# Altium project SMD_Bed_Main.PrjPcb
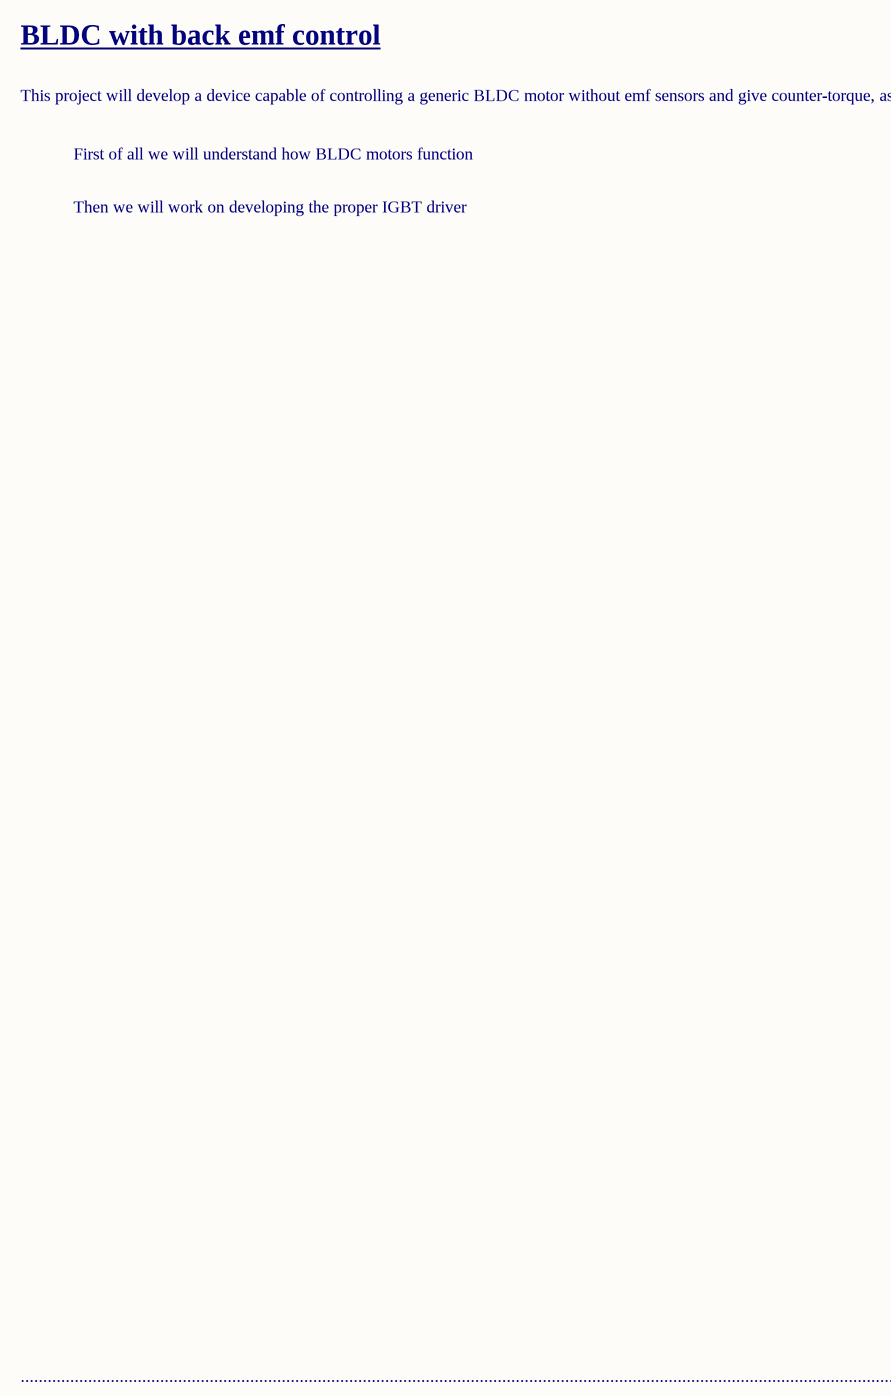
[diagram p0: 000-Cover.SchDoc]
4 sheets, 27 parts. Net scope: global (net labels, ports and power ports of the same name join across sheets).
Board file: SMD_Bed_Main_revA.PcbDoc
Sheets:
  000-Change logs.SchDoc
  000-Cover.SchDoc
  001-Main.SchDoc
  002-MCU.SchDoc

## Sheet 000-Change logs.SchDoc
size A4; SheetNumber: 1; SheetTotal: 5

## Sheet 000-Cover.SchDoc
size 431 x 279 mm; Organization: ORGANIZATION; Address1: ADDRESS 1; Address2: ADDRESS 2; Address3: ADDRESS 3; Address4: ADDRESS 4; Revision: -; ENG_APP_DATE: --/--/--; DSN_APP_DATE: --/--/--; CHK_APP_DATE: --/--/--

### Notes on the sheet
- BLDC with back emf control
- This project will develop a device capable of controlling a generic BLDC motor without emf sensors and give counter-torque, as the steering wheel of a F1 simulator
- First of all we will understand how BLDC motors function
- Then we will work on developing the proper IGBT driver
- ..........................................................................................................................................................................................................................................................................
- DWG. NO.
- REV.
- SHT.
- THIS DOCUMENT AND THE DATA DISCLOSED HEREIN OR HEREWITH IS THE PROPERTY OF ALTIUM LIMITED AND MAY BE FREELY DISTRIBUTED IN WHOLE. NO RIGHTS ARE RESERVED OR EXPRESS OR IMPLIED WARANTEE GIVEN.
- REVISION
- DESCRIPTION
- DATE
- APPROVED
- ENG:
- APPROVALS
- PROJECT
- DSN:
- CHK:
- REFERENCE DOCUMENTS
- PROJECT REVISION:
- TITLE
- DOCUMENT REVISION:
- DESIGN ITEM:
- BOM:
- FAB DWG:
- PCB DWG:
- ASSY DWG:
- SCALE:
- SIZE
- B
- CAGE CODE
- FILE NAME
- DWG NO.
- SHEET
- OF
- REV

## Sheet 001-Main.SchDoc
size A4; SheetNumber: 4; SheetTotal: 5
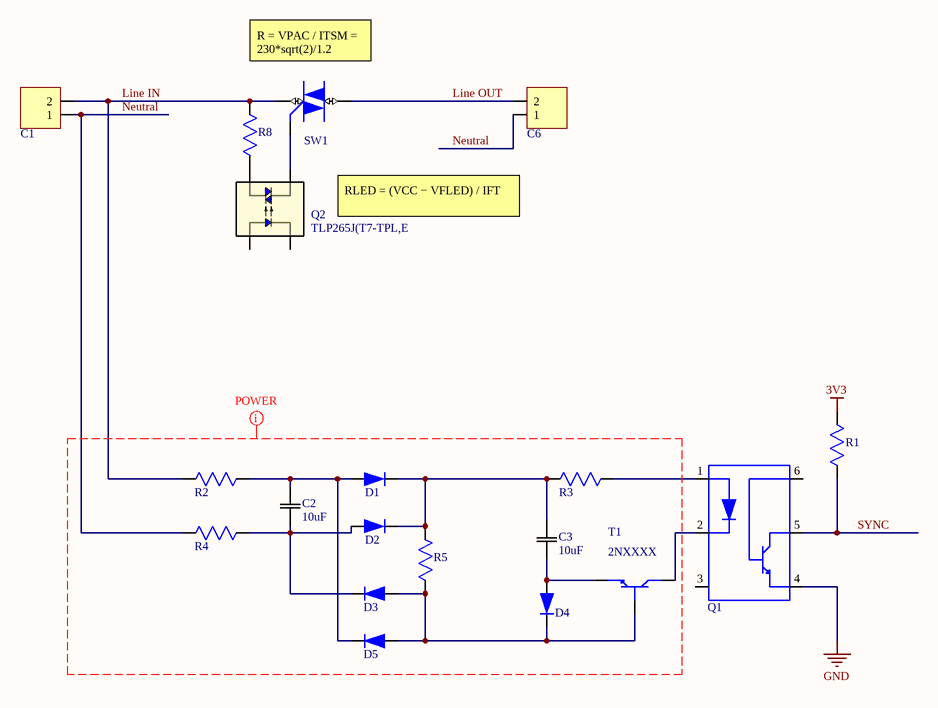
[diagram p1: 001-Main.SchDoc]

### Parts
C1  DG128-5.0-02P-14  [DG128-5.0-02P-14]  (value not drawn)
C2  10uF  [CAP 0603/1608]
C3  10uF  [CAP 0603/1608]
C6  DG128-5.0-02P-14  [DG128-5.0-02P-14]  (value not drawn)
D1  MMSD4148T1G  [SOD-123]  (value not drawn)
D2  MMSD4148T1G  [SOD-123]  (value not drawn)
D3  MMSD4148T1G  [SOD-123]  (value not drawn)
D4  MMSD4148T1G  [SOD-123]  (value not drawn)
D5  MMSD4148T1G  [SOD-123]  (value not drawn)
Q1  4N35  [DIP6-2.54]  (value not drawn)
Q2  TLP265J(T7-TPL,E  [4pin SO6_TOS]
R1  CRCW06031K00FKEA  [CAP 0603/1608]  (value not drawn)
R2  CRCW06031K00FKEA  [CAP 0603/1608]  (value not drawn)
R3  CRCW06031K00FKEA  [CAP 0603/1608]  (value not drawn)
R4  CRCW06031K00FKEA  [CAP 0603/1608]  (value not drawn)
R5  CRCW06031K00FKEA  [CAP 0603/1608]  (value not drawn)
R8  CRCW06031K00FKEA  [CAP 0603/1608]  (value not drawn)
SW1  T810T-8G-TR  [D2PAK]  (value not drawn)
T1  2NXXXX  [TO-92]

### Nets
3V3: R1.2
GND: Q1.4(EMITER)
Line IN: C1.2 R2.1 R8.2 SW1.1(A1)
Line OUT: C6.2 SW1.2(A2)
Neutral: C1.1 C6.1 R4.1
SYNC: Q1.5(COLLECTOR) R1.1
NetC2_1: C2.1 D2.1(K) D3.2(A) R4.2
NetC2_2: C2.2 D1.1(K) D5.2(A) R2.2
NetC3_1: C3.1 D4.1(K) T1.3(E)
NetC3_2: C3.2 D1.2(A) D2.2(A) R3.1 R5.1
NetD3_1: D3.1(K) D4.2(A) D5.1(K) R5.2 T1.1(B)
NetQ1_1: Q1.1(ANODE) R3.2
NetQ1_2: Q1.2(CATHODE) T1.2(C)
NetQ2_4: Q2.4 SW1.3(G)
NetQ2_6: Q2.6 R8.1

Not connected (* = marked no-connect by the designer): Q1 3(NC) 6(BASE); Q2 1 3

### Layout directives
net class AC; rule Supply Nets [Voltage = 230.0]; rule Signal Stimulus [Kind - Single Pulse    Level - High    Start Time = 0.000    Stop Time = 10.00m    Period Time = 20.00m]: (no net found under the mark)

### Notes on the sheet
- R = VPAC / ITSM = 230*sqrt(2)/1.2
- RLED = (VCC − VFLED) / IFT

### Library data of the parts
C1 C6 = Connector 2P 5.0mm
C2 C3 = CL10A106KQ8NNNC: CAP 10uF Ceramic 0603 capacitor; Mfr_Name: Samsung
D1-D5 = MMSD4148T1G: DIODE; Manufacturer_Name: onsemi; Copyright: Copyright (C) 2025 Ultra Librarian. All rights reserved.; Manufacturer_Part_Number: MMSD4148T1G; RefDes: RefDes; Type: Type
Q1 = 4N35: Optoisolator Transistor with Base Output 5000Vrms 1 Channel 6-DIP; MF: Vishay; Purchase-URL: https://pricing.snapeda.com/search/part/4N35/?ref=eda; Price: None; SnapEDA_Link: https://www.snapeda.com/parts/4N35/Vishay%20Semiconductor%20Opto%20Division/view-part/579099/?ref=snap; MP: 4N35; Availability: Good; Value: *; Check_prices: https://www.snapeda.com/parts/4N35/Vishay%20Semiconductor%20Opto%20Division/view-part/579099/?ref=eda; Package: DIP-6 Texas Instruments
Q2 = TLP265JT7-TPL,E: No Description Available; Manufacturer_Name: Toshiba Electronic Devices & Storage Corp.; Number_devices_in_Package: 1; Copyright: Copyright (C) 2025 Ultra Librarian. All rights reserved.; Manufacturer_Part_Number: TLP265J(T7-TPL,E; Source_Package: TLP265J; RefDes: Refdes; Type: Type
R1-R5 R8 = CRCW06031K00FKEA: D11/CRCW0603 100 1K 1% ET1 e3; Manufacturer_Name: Vishay; Copyright: Copyright (C) 2025 Ultra Librarian. All rights reserved.; Manufacturer_Part_Number: CRCW06031K00FKEA; Datasheet: https://www.vishay.com/doc?20035
SW1 = T810T-8G-TR: 8A 800V 150&#176;C D&#178;PAK Logic Level T-Series Triac; Manufacturer_Name: STMicroelectronics; Copyright: Copyright (C) 2025 Ultra Librarian. All rights reserved.; Manufacturer_Part_Number: T810T-8G-TR; Datasheet: https://www.st.com/resource/en/datasheet/t810t-8g.pdf; RefDes: RefDes; Type: Type

## Sheet 002-MCU.SchDoc
size A4; SheetNumber: 5; SheetTotal: 5
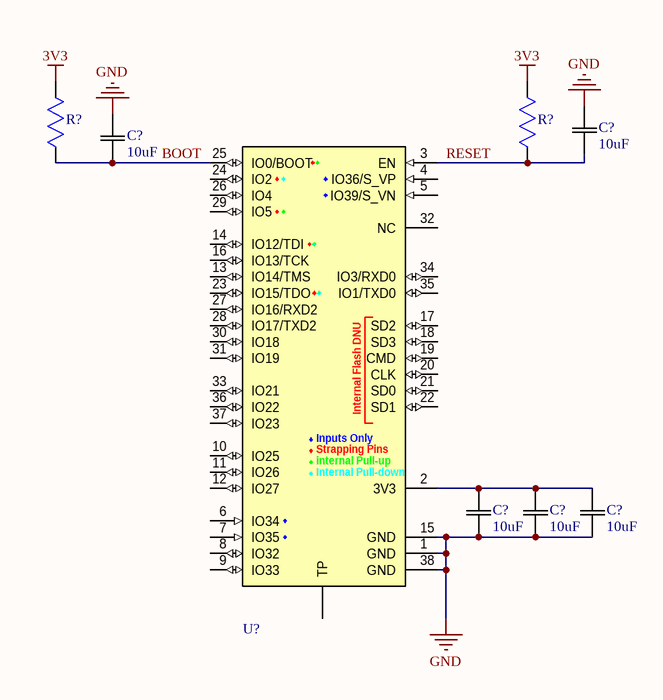
[diagram p2: 002-MCU.SchDoc]

### Parts
(Parts that share a designator on the sheet are numbered #1, #2 ... from top to bottom, then left to right.)
C?#1  10uF  [CAP 0603/1608]
C?#2  10uF  [CAP 0603/1608]
C?#3  10uF  [CAP 0603/1608]
C?#4  10uF  [CAP 0603/1608]
C?#5  10uF  [CAP 0603/1608]
R?#1  CRCW06031K00FKEA  [CAP 0603/1608]  (value not drawn)
R?#2  CRCW06031K00FKEA  [CAP 0603/1608]  (value not drawn)
U?  Red markers can't be pull up. Blue markers can't be pull down.  [ESP32­WROOM­32E_EXP]  (value not drawn)

### Nets
3V3: R?#1.2 R?#2.2
GND: C?#1.2 C?#2.2 C?#3.1 C?#4.1 C?#5.1 U?.1(GND) U?.15(GND) U?.38(GND)
BOOT: C?#2.1 R?#1.1 U?.25(IO0/BOOT)
RESET: C?#1.1 R?#2.1 U?.3(EN)
NetC?#3_2: C?#3.2 C?#4.2 C?#5.2 U?.2(3V3)

Not connected (* = marked no-connect by the designer): U? 4(IO36/S_VP) 5(IO39/S_VN) 6(IO34) 7(IO35) 8(IO32) 9(IO33) 10(IO25) 11(IO26) 12(IO27) 13(IO14/TMS) 14(IO12/TDI) 16(IO13/TCK) 17(SD2) 18(SD3) 19(CMD) 20(CLK) 21(SD0) 22(SD1) 23(IO15/TDO) 24(IO2) 26(IO4) 27(IO16/RXD2) 28(IO17/TXD2) 29(IO5) 30(IO18) 31(IO19) 32(NC) 33(IO21) 34(IO3/RXD0) 35(IO1/TXD0) 36(IO22) 37(IO23) TP

### Notes on the sheet
- (in symbol ESP-WROOM-32) Internal Flash DNU; Inputs Only; Strapping Pins; internal Pull-up; Internal Pull-down

### Library data of the parts
C?#1-C?#5 = CL10A106KQ8NNNC: as C2 on sheet 001-Main
R?#1 R?#2 = CRCW06031K00FKEA: as R1 on sheet 001-Main; Copyright: Copyright (C) 2025 Ultra Librarian. All rights reserved.; Manufacturer_Part_Number: CRCW06031K00FKEA; Datasheet: https://www.vishay.com/doc?20035
U? = ESP-WROOM-32: ESP32 MCU

## Nets that join several sheets
3V3: 001-Main (R1.2), 002-MCU (R?#1.2 R?#2.2)
GND: 001-Main (Q1.4), 002-MCU (8 pins)